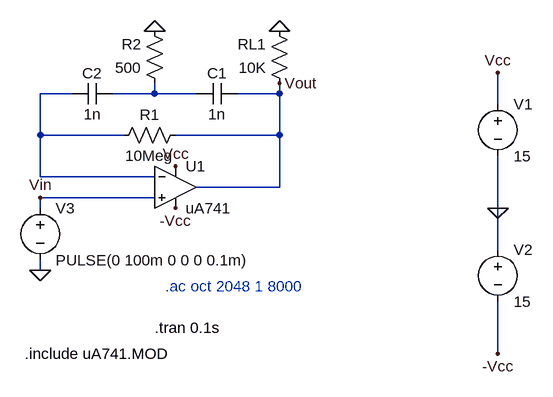
[diagram p0: schematic opamp_uA741.asc]
opamp_uA741.asc, the LTspice schematic file:
Version 4
SHEET 1 880 680
WIRE 96 144 48 144
WIRE 224 144 224 128
WIRE 224 144 160 144
WIRE 288 144 224 144
WIRE 416 144 416 128
WIRE 416 144 352 144
WIRE 752 160 752 112
WIRE 48 208 48 144
WIRE 176 208 48 208
WIRE 416 208 416 144
WIRE 416 208 256 208
WIRE 48 272 48 208
WIRE 224 272 48 272
WIRE 416 288 416 208
WIRE 416 288 288 288
WIRE 224 304 48 304
WIRE 48 320 48 304
WIRE 752 320 752 240
WIRE 752 384 752 320
WIRE 48 416 48 400
WIRE 752 544 752 464
FLAG 752 320 0
FLAG 752 112 Vcc
FLAG 752 544 -Vcc
FLAG 256 256 Vcc
FLAG 256 320 -Vcc
FLAG 224 48 0
FLAG 416 48 0
FLAG 48 416 0
FLAG 48 304 Vin
FLAG 416 128 Vout
SYMBOL /Opamps/opamp2 256 224 R0
SYMATTR InstName U1
SYMATTR Value uA741
SYMBOL /voltage 752 144 R0
SYMATTR InstName V1
SYMATTR Value 15
SYMBOL /voltage 752 368 R0
SYMATTR InstName V2
SYMATTR Value 15
SYMBOL /voltage 48 304 R0
SYMATTR InstName V3
SYMATTR Value PULSE(0 100m 0 0 0 0.1m)
SYMATTR SpiceLine Rser=1
SYMBOL /res 272 192 R90
WINDOW 0 0 56 VBottom 2
WINDOW 3 32 56 VTop 2
SYMATTR InstName R1
SYMATTR Value 10Meg
SYMBOL /res 240 144 R180
WINDOW 0 36 76 Left 2
WINDOW 3 36 40 Left 2
SYMATTR InstName R2
SYMATTR Value 500
SYMBOL /res 432 144 R180
WINDOW 0 36 76 Left 2
WINDOW 3 36 40 Left 2
SYMATTR InstName RL1
SYMATTR Value 10K
SYMBOL /cap 352 128 R90
WINDOW 0 0 32 VBottom 2
WINDOW 3 32 32 VTop 2
SYMATTR InstName C1
SYMATTR Value 1n
SYMBOL /cap 160 128 R90
WINDOW 0 0 32 VBottom 2
WINDOW 3 32 32 VTop 2
SYMATTR InstName C2
SYMATTR Value 1n
TEXT 24 544 Left 2 !.include uA741.MOD
TEXT 224 504 Left 2 !.tran 0.1s
TEXT 240 440 Left 2 ;.ac oct 2048 1 8000

The netlist it stands for:
* opamp_uA741.asc
XU1 Vin N001 Vcc -Vcc Vout uA741  ; pins In+ In- V+ V- OUT
V1 Vcc 0 15
V2 0 -Vcc 15
V3 Vin 0 PULSE(0 100m 0 0 0 0.1m) Rser=1
R1 Vout N001 10Meg
R2 N002 0 500
RL1 Vout 0 10K
C1 Vout N002 1n
C2 N002 N001 1n
.include uA741.MOD
.tran 0.1s
* .ac oct 2048 1 8000
.backanno
.end